# EAGLE schematic Wiring (EAGLE 8.4.1)

## Sheet 1 of 2
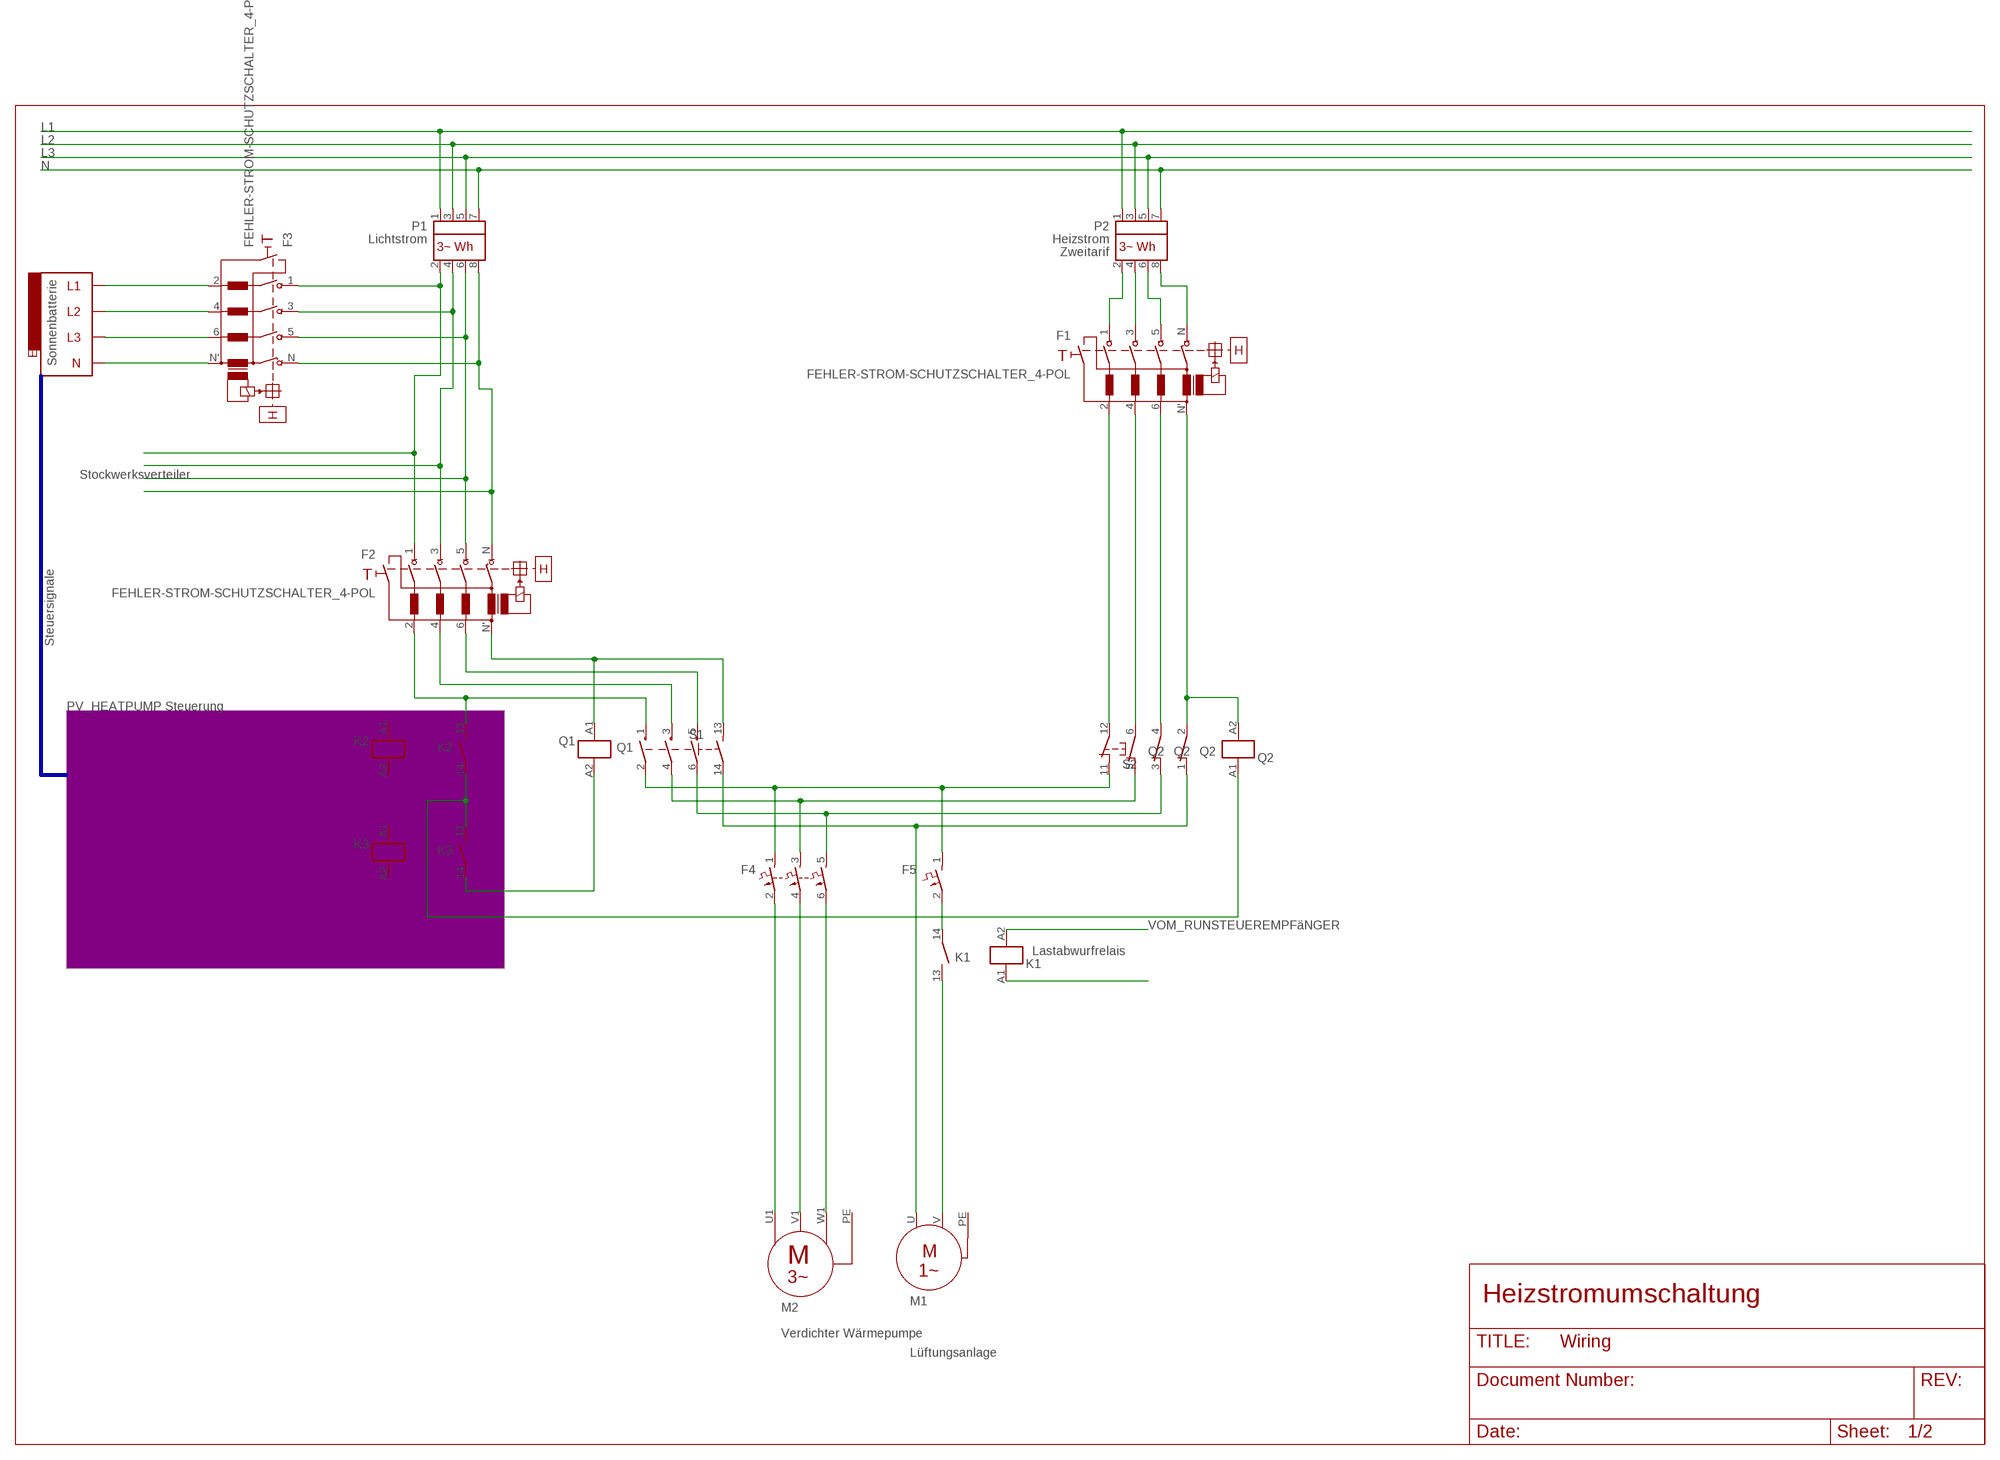
[diagram p0: schematic, sheet 1]

### Parts
F1  FEHLER-STROM-SCHUTZSCHALTER_4-POL  [FEHLER-STROM-SCHUTZSCHALTER_4-POL]
F2  FEHLER-STROM-SCHUTZSCHALTER_4-POL  [FEHLER-STROM-SCHUTZSCHALTER_4-POL]
F3  FEHLER-STROM-SCHUTZSCHALTER_4-POL  [FEHLER-STROM-SCHUTZSCHALTER_4-POL]
F4  LEITUNGSSCHUTZSCHALTER_3-POL  [LEITUNGSSCHUTZSCHALTER_3-POL]
F5  LEITUNGSSCHUTZSCHALTER  [LEITUNGSSCHUTZSCHALTER]
K1  HILFSSCHUETZ_13-14  [HILFSSCHUETZ_13-14]
K2  HILFSSCHUETZ_13-14  [HILFSSCHUETZ_13-14]
K3  HILFSSCHUETZ_13-14  [HILFSSCHUETZ_13-14]
M1  MOTOR_1-PHASEN  [MOTOR_1-PHASEN]
M2  MOTOR_3-POL_PE  [MOTOR_3-POL_PE]
P1  Lichtstrom  DREHSTROMZAEHLER  [DREHSTROMZAEHLER]
P2  Heizstrom  DREHSTROMZAEHLER  [DREHSTROMZAEHLER]
Q1  HAUPTSCHUETZ_3-POL  [HAUPTSCHUETZ_3-POL]
Q2  HAUPTSCHUETZ_3-POL_ÖFFNER  [HAUPTSCHUETZ_3-POL]
S1  SCHLIESSER_HANDBETAETIGT  [SCHLIESSER_HANDBETAETIGT]
S2  OEFFNER_TASTSCHALTER  [OEFFNER_TASTSCHALTER]

### Nets
L1: P1.1(I1) P2.1(I1)
L1-EXT: F3.2 ; supply symbol labelled Sonnenbatterie
L2: P1.3(U1) P2.3(U1)
L2-EXT: F3.4 ; supply symbol labelled Sonnenbatterie
L3: P1.5(U3) P2.5(U3)
L3-EXT: F3.6 ; supply symbol labelled Sonnenbatterie
N: P1.7(U5) P2.7(U5)
N$1: F2.N F3.N P1.8(U6)
N$2: F2.5 F3.5 P1.6(U4)
N$3: F2.3 F3.3 P1.4(U2)
N$4: F2.1 F3.1 P1.2(I2)
N$5: F2.N' Q1.A1 S1.13
N$6: F2.6 Q1.5
N$7: F2.4 Q1.3
N$8: F2.2 K2.13 Q1.1
N$9: F1.2 S2.12
N$10: F1.4 Q2.6
N$11: F1.6 Q2.4
N$12: F1.N' Q2.2 Q2.A2
N$13: F1.N P2.8(U6)
N$14: F1.5 P2.6(U4)
N$15: F1.3 P2.4(U2)
N$16: F1.1 P2.2(I2)
N$17: M1.U Q2.1 S1.14
N$18: F4.1 F5.1 Q1.2 S2.11
N$19: F4.3 Q1.4 Q2.5
N$20: F4.5 Q1.6 Q2.3
N$21: F5.2 K1.14
N$22: K1.13 M1.V
N$23: F4.2 M2.U1
N$24: F4.4 M2.V1
N$25: F4.6 M2.W1
N$26: K2.14 K3.13 Q2.A1
N$27: K1.A1
N$28: K3.14 Q1.A2
PE-EXT: F3.N' ; supply symbol labelled Sonnenbatterie
VOM_RUNSTEUEREMPFäNGER: K1.A2
Unconnected: K2.A1 K2.A2 K3.A1 K3.A2 M1.PE M2.PE

### Buses
B$1

### Notes on the sheet
- Stockwerksverteiler
- Steuersignale
- PV_HEATPUMP Steuerung
- Lastabwurfrelais
- Heizstromumschaltung

## Sheet 2 of 2
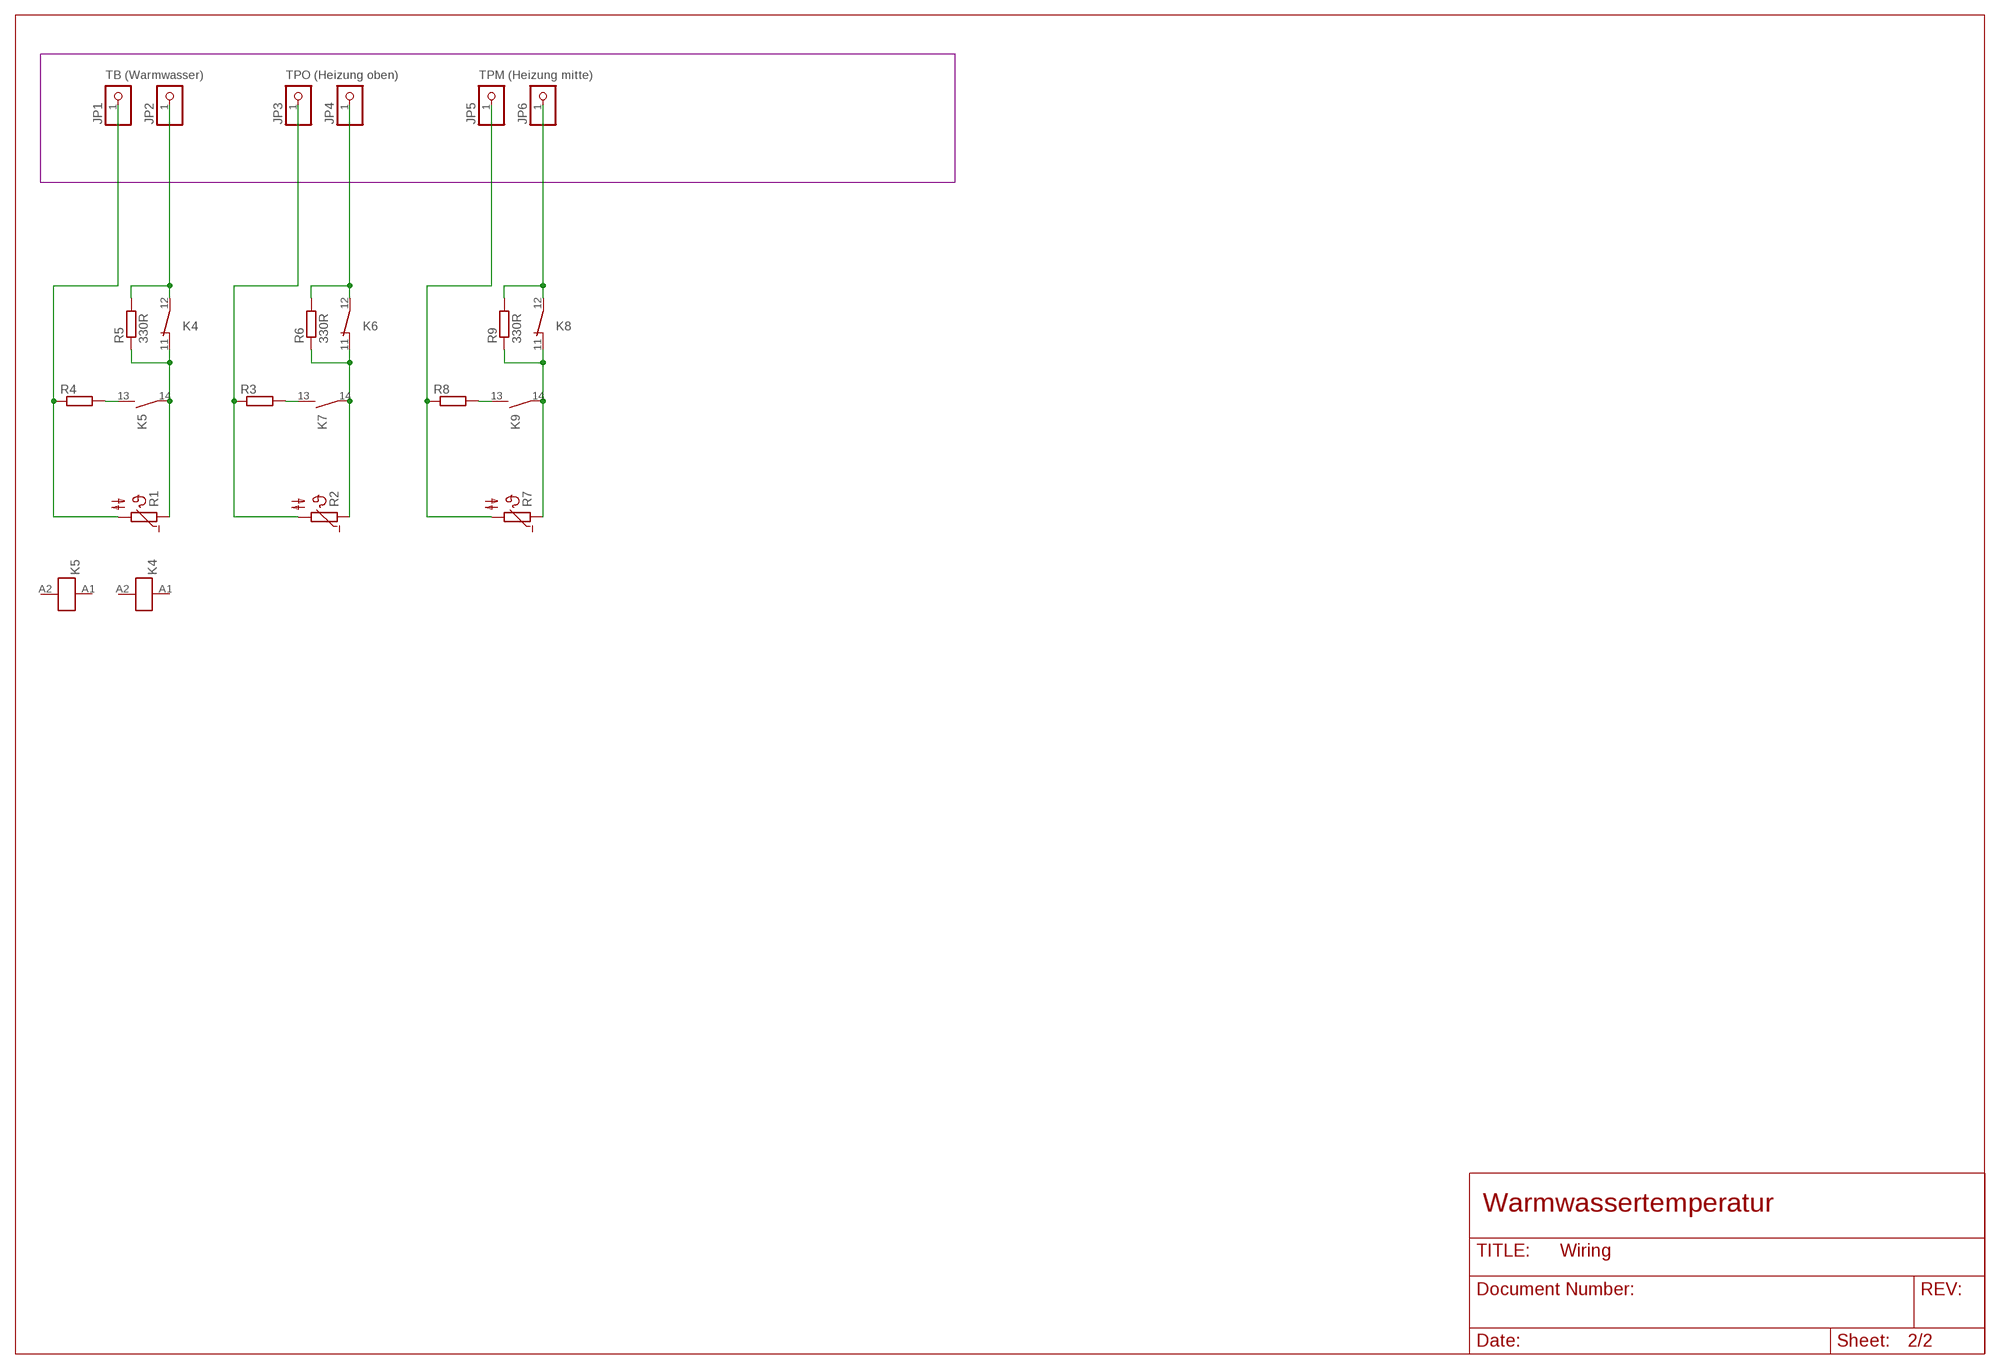
[diagram p1: schematic, sheet 2]

### Parts
JP1  PINHD-1X1  [1X01]
JP2  PINHD-1X1  [1X01]
JP3  PINHD-1X1  [1X01]
JP4  PINHD-1X1  [1X01]
JP5  PINHD-1X1  [1X01]
JP6  PINHD-1X1  [1X01]
K4  HILFSSCHUETZ_11-12  [HILFSSCHUETZ_11-12]
K5  HILFSSCHUETZ_13-14  [HILFSSCHUETZ_13-14]
K6  HILFSSCHUETZ_11-12  [HILFSSCHUETZ_11-12]
K7  HILFSSCHUETZ_13-14  [HILFSSCHUETZ_13-14]
K8  HILFSSCHUETZ_11-12  [HILFSSCHUETZ_11-12]
K9  HILFSSCHUETZ_13-14  [HILFSSCHUETZ_13-14]
R1  NTC644A  [N644A]
R2  NTC644A  [N644A]
R3  R-EU_0204/2V  [0204V]
R4  R-EU_0204/2V  [0204V]
R5  330R  R-EU_0204/2V  [0204V]
R6  330R  R-EU_0204/2V  [0204V]
R7  NTC644A  [N644A]
R8  R-EU_0204/2V  [0204V]
R9  330R  R-EU_0204/2V  [0204V]

### Nets
N$29: K4.11 K5.14 R1.1 R5.1
N$30: JP2.1 K4.12 R5.2
N$31: JP1.1 R1.2 R4.1
N$32: K5.13 R4.2
N$33: K6.11 K7.14 R2.1 R6.1
N$34: K6.12 R6.2
N$35: R2.2 R3.1
N$36: K7.13 R3.2
N$37: K8.11 K9.14 R7.1 R9.1
N$38: K8.12 R9.2
N$39: R7.2 R8.1
N$40: K9.13 R8.2
Unconnected: JP3.1 JP4.1 JP5.1 JP6.1 K4.A1 K4.A2 K5.A1 K5.A2 K6.A1 K6.A2 K7.A1 K7.A2 K8.A1 K8.A2 K9.A1 K9.A2

### Notes on the sheet
- TB (Warmwasser) | TPO (Heizung oben) | TPM (Heizung mitte)
- Warmwassertemperatur

## Library data of the parts
F1-F3 = e-sicherungen:FEHLER-STROM-SCHUTZSCHALTER_4-POL: Fehlerstromschutzschalter (FI) 4-pol mit Prüftaster
F4 = e-sicherungen:LEITUNGSSCHUTZSCHALTER_3-POL: Leitungsschutzschalter, 3-pol.
F5 = e-sicherungen:LEITUNGSSCHUTZSCHALTER: Sicherung
JP1-JP6 = pinhead:PINHD-1X1: PIN HEADER
K1-K3 K5 K7 K9 = e-schuetze-relais:HILFSSCHUETZ_13-14: Hilfsschütz mit 1 Schließer
K4 K6 K8 = e-schuetze-relais:HILFSSCHUETZ_11-12: Hilfsschütz mit 1 Öffner
M1 = e-motoren:MOTOR_1-PHASEN: 1-Phasen-Wechselstrom-Motor; FUNKTION: Lüftungsanlage
M2 = e-motoren:MOTOR_3-POL_PE: 3-Phasen-Motor mit PE; TYPE: Verdichter Wärmepumpe
P1 = e-messinstrumente:DREHSTROMZAEHLER: Energiezähler, Wattstundenzähler; TYPE: 123
P2 = e-messinstrumente:DREHSTROMZAEHLER: Energiezähler, Wattstundenzähler; TYPE: Zweitarif
Q1 = e-schuetze-relais:HAUPTSCHUETZ_3-POL: Hauptschütz mit 3 Schließern
Q2 = e-schuetze-relais:HAUPTSCHUETZ_3-POL_ÖFFNER: Hauptschütz mit 3 Schließern
R1 R2 R7 = ptc-ntc:NTC644A: PHILIPS NTC; OC_FARNELL: unknown; OC_NEWARK: unknown
R3-R6 R8 R9 = rcl:R-EU_: RESISTOR, European symbol
S1 = e-schalter:SCHLIESSER_HANDBETAETIGT: Schließer, handbetätigt
S2 = e-schalter:OEFFNER_TASTSCHALTER: Tastschalter, Öffner